# Altium schematic sheet [08] - RS232.SchDoc
size A3; DocumentNumber: 8; SheetNumber: 8; SheetTotal: 18
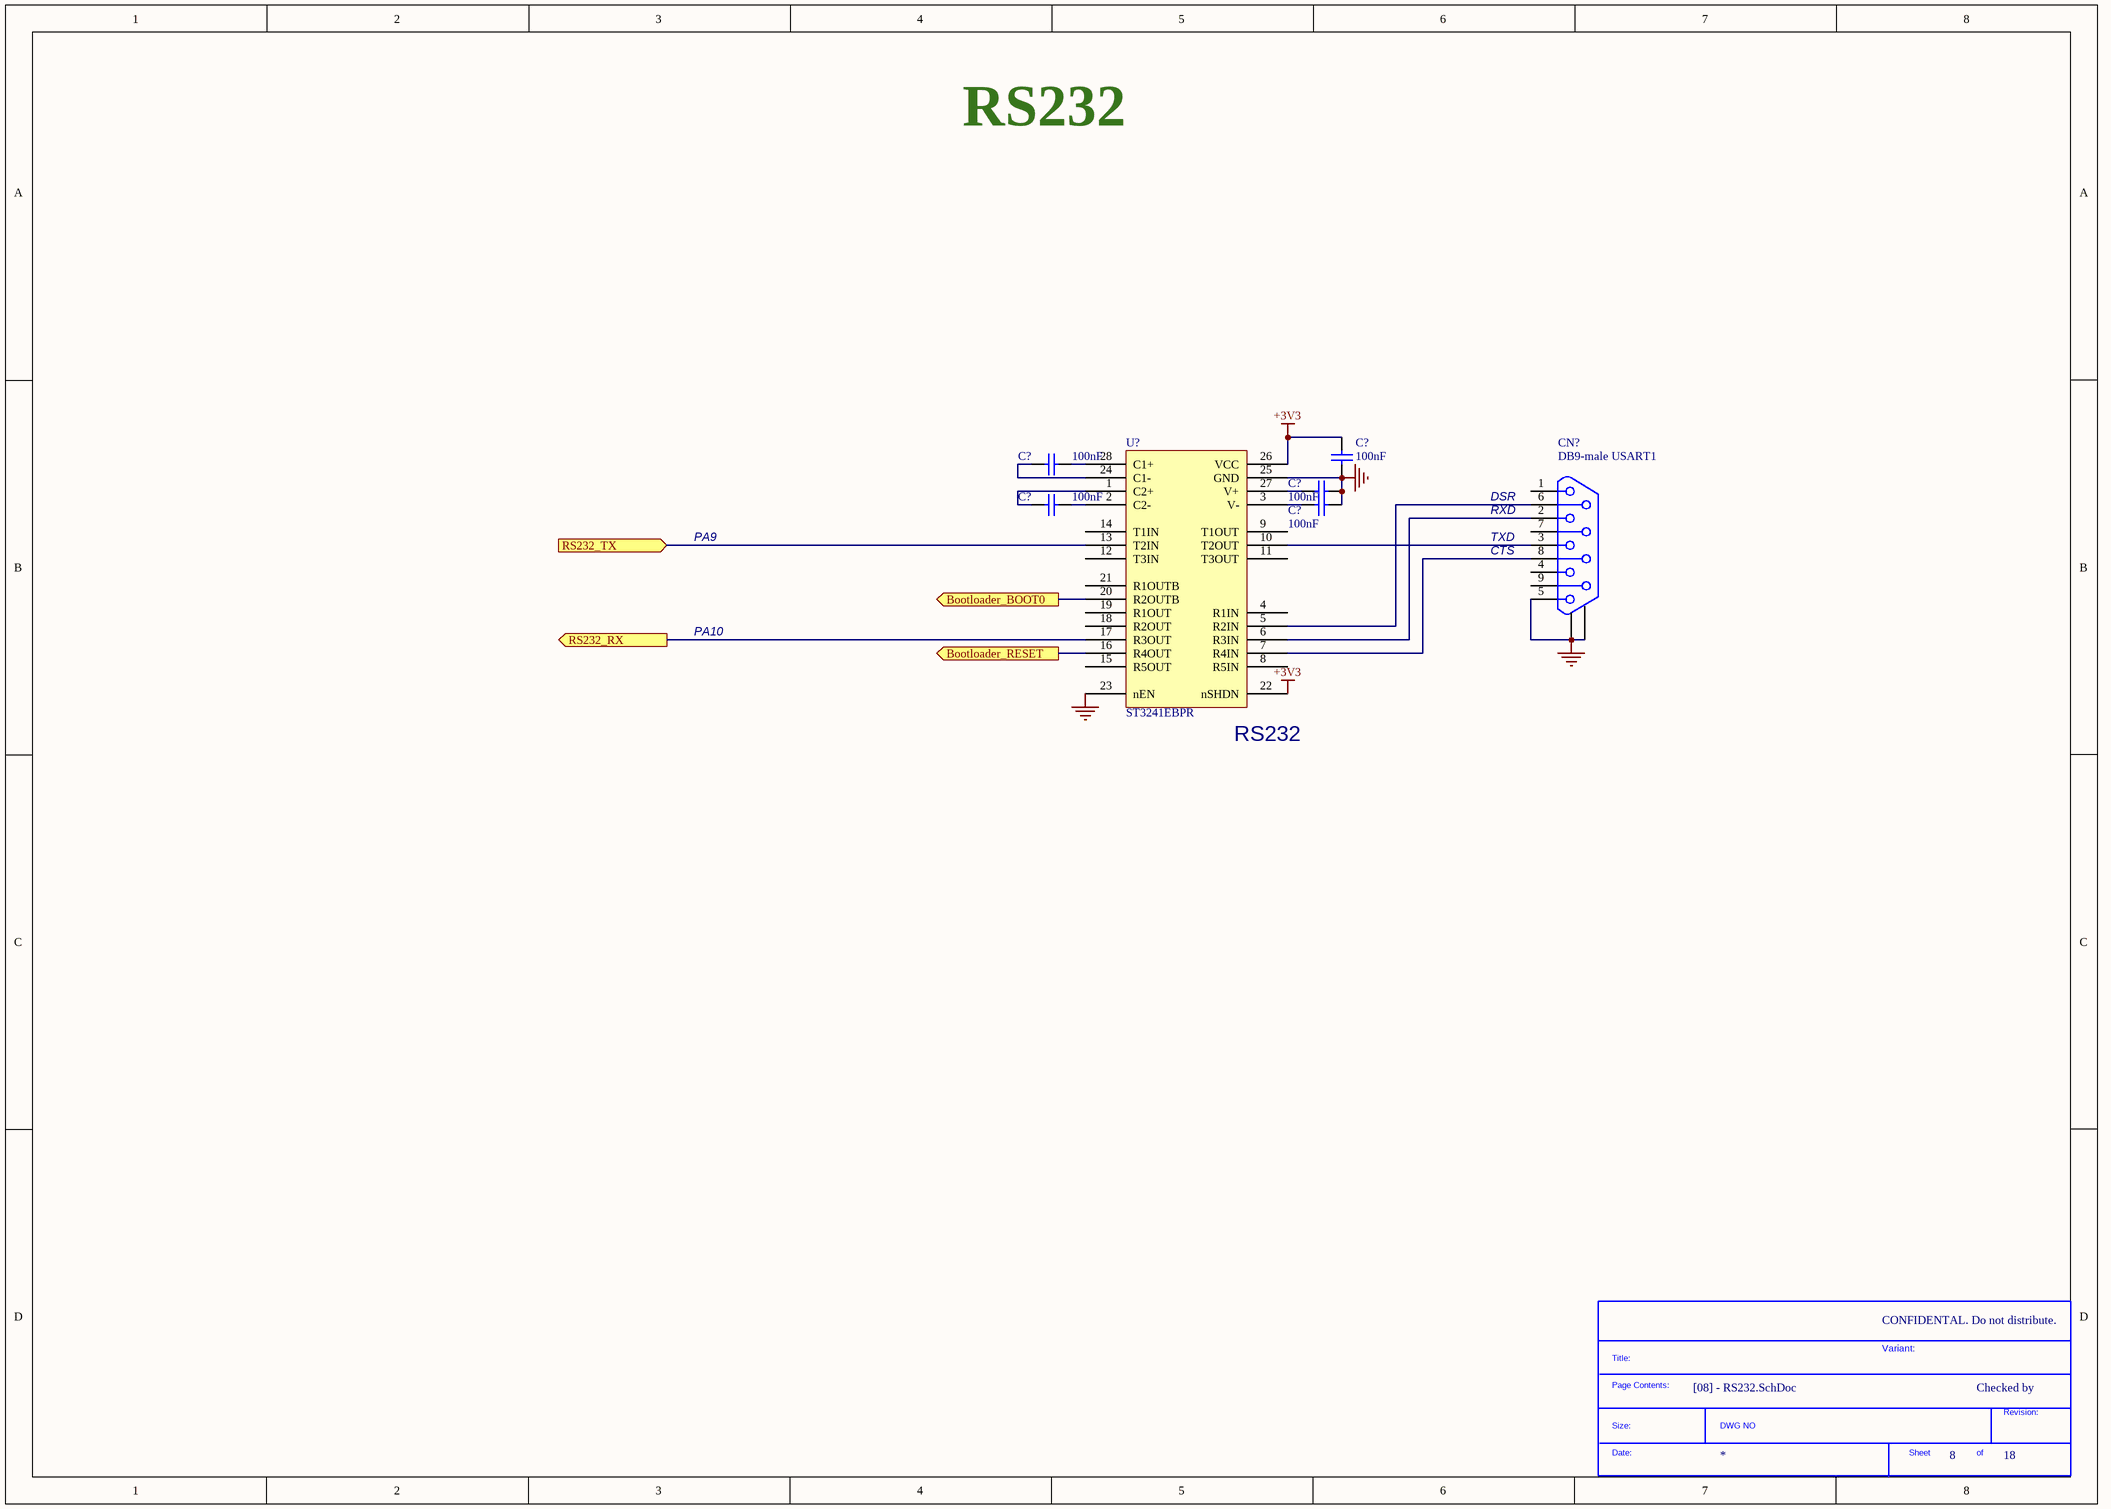
[diagram p0: [08] - RS232.SchDoc]

## Parts
(Parts that share a designator on the sheet are numbered #1, #2 ... from top to bottom, then left to right.)
*  SDTitleBlock  (value not drawn)  (graphical)
C?#1  100nF  [0603C]
C?#2  100nF  [0603C]
C?#3  100nF  [0603C]
C?#4  100nF  [0603C]
C?#5  100nF  [0603C]
CN?  DB9-male USART1  [DB9/M]
U?  ST3241EBPR  [SSOP28_0R65_10R2X7R8]

## Ports
Bootloader_BOOT0 (out), Bootloader_RESET (out), RS232_RX (out), RS232_TX (in)

## Nets
+3V3: C?#2.1 U?.22(nSHDN) U?.26(VCC)
GND: C?#2.2 C?#4.1 C?#5.1 CN?.5 CN?.10 CN?.11 U?.23(nEN) U?.25(GND)
Bootloader_BOOT0: U?.20(R2OUTB) ; port Bootloader_BOOT0
Bootloader_RESET: U?.16(R4OUT) ; port Bootloader_RESET
RS232_RX: U?.17(R3OUT) ; port RS232_RX
RS232_TX: U?.13(T2IN) ; port RS232_TX
NetC?#1_1: C?#1.1 U?.24(C1-)
NetC?#1_2: C?#1.2 U?.28(C1+)
NetC?#3_1: C?#3.1 U?.1(C2+)
NetC?#3_2: C?#3.2 U?.2(C2-)
NetC?#4_2: C?#4.2 U?.27(V+)
NetC?#5_2: C?#5.2 U?.3(V-)
NetCN?_2: CN?.2 U?.6(R3IN)
NetCN?_3: CN?.3 U?.10(T2OUT)
NetCN?_6: CN?.6 U?.5(R2IN)
NetCN?_8: CN?.8 U?.7(R4IN)

Not connected (* = marked no-connect by the designer): CN? 1 4 7 9; U? 4(R1IN) 8(R5IN) 9(T1OUT) 11(T3OUT) 12(T3IN) 14(T1IN) 15(R5OUT) 18(R2OUT) 19(R1OUT) 21(R1OUTB)

## Notes on the sheet
- RS232
- (near CN?) RXD
- (near CN?) DSR
- PA9
- (near CN?) TXD
- (near CN?) CTS
- PA10
- (near U?) RS232
- CONFIDENTAL. Do not distribute.
- CLOCKS (CPU & PCIE)
- Variant:
- Checked by
- (in symbol SDTitleBlock) Title:; Page Contents:; Revision:; Size:; DWG NO; Date:; Sheet; of

## Library data of the parts
C?#1-C?#5 = Cap: Capacitor; Value: 10nF; Published: 8-Jun-2000; Revision: July-2002: Re-released for DXP Platform.; Publisher: Altium Limited
CN? = DB9-USART
U? = ST3241